# EAGLE design Addon-LAN-WLAN-without-MAPLE_or-OneWire_or_RS485-V01-010 (EAGLE 9.3.0)
MAPLE-CUx Large Version
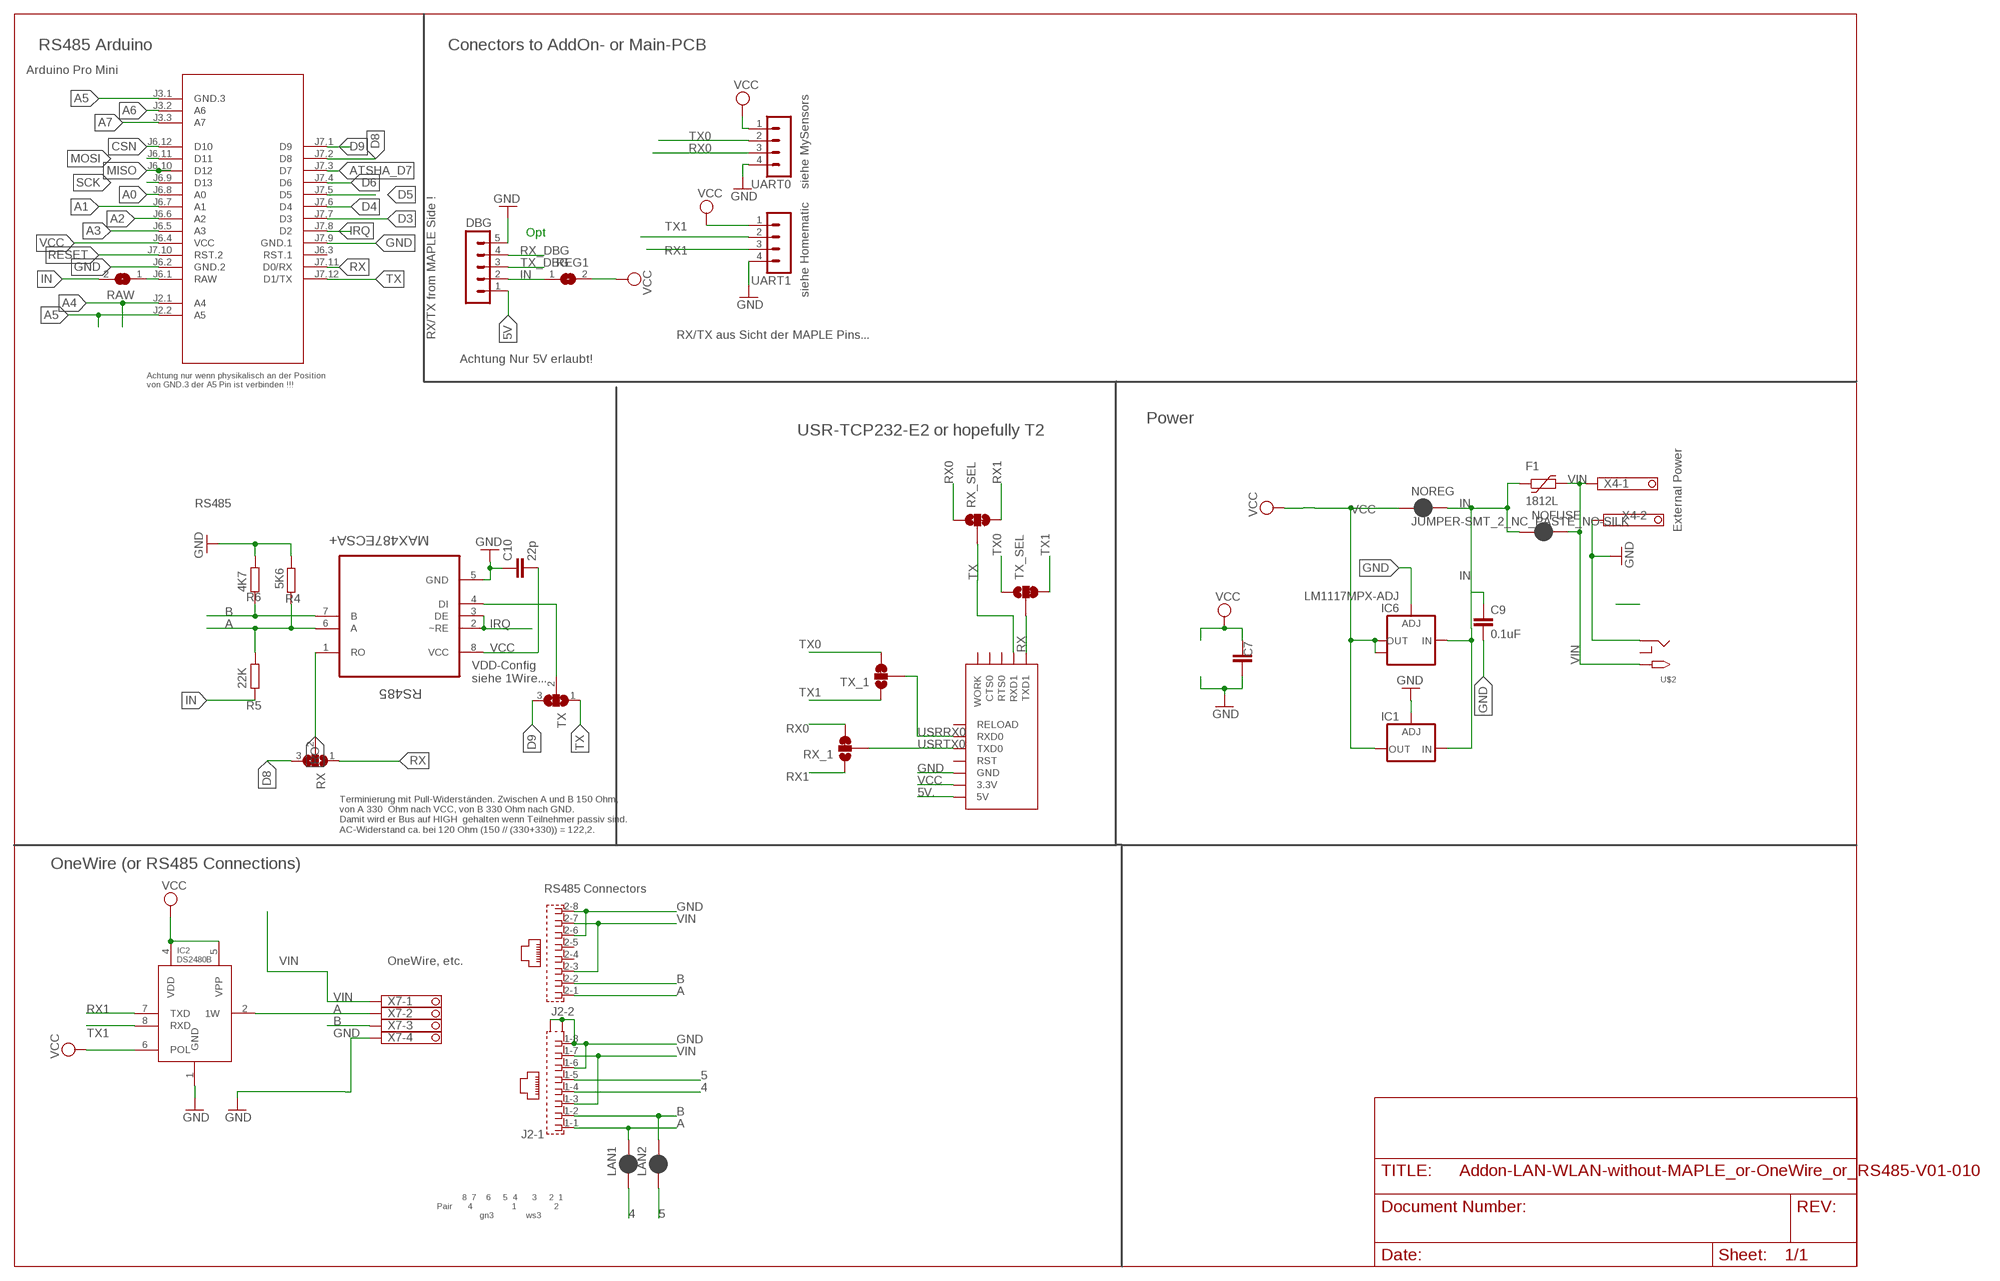
[diagram p0: schematic, sheet 1]

## Parts
C7  C-EUC1812  [C1812]
C9  0.1uF  C-EUC1206  [C1206]
C10  22p  C-EUC0805  [C0805]
DBG  MA05-1  [MA05-1]
F1  1812L  [1812L]
IC1  LD117ADT50TR  [DPACK]
IC2  DS2480B  [SO08]
IC6  LM1117MPX-ADJ  [SOT223]
J2  RJ45_2X_S  [RJ45_2X_S]
LAN1  JUMPER-SMT_2_NC_PASTE_SILK  [SMT-JUMPER_2_NC_PASTE_SILK]
LAN2  JUMPER-SMT_2_NC_PASTE_SILK  [SMT-JUMPER_2_NC_PASTE_SILK]
M1  ARDUINO-PRO-MINI-3.3V#NP  [ARDUINO-PRO-MINI#NP]
NOFUSE  JUMPER-SMT_2_NC_PASTE_NO-SILK  [SMT-JUMPER_2_NC_PASTE_NO-SILK]
NOREG  JUMPER-SMT_2_NC_PASTE_NO-SILK  [SMT-JUMPER_2_NC_PASTE_NO-SILK]
R4  5K6  R-EU_R0805  [R0805]
R5  22K  R-EU_R0805  [R0805]
R6  4K7  R-EU_R0805  [R0805]
RAW  SJ  [SJ]
REG1  SJ  [SJ]
RS485  MAX487ECSA+  [SOIC127P600X175-8N]
RX  SJ2W  [SJ_2]
RX_1  JUMPER-SMT_3_1-NC_TRACE_SILK  [SMT-JUMPER_3_1-NC_TRACE_SILK]
RX_SEL  JUMPER-SMT_3_1-NC_TRACE_SILK  [SMT-JUMPER_3_1-NC_TRACE_SILK]
TX  SJ2W  [SJ_2]
TX_1  JUMPER-SMT_3_1-NC_TRACE_SILK  [SMT-JUMPER_3_1-NC_TRACE_SILK]
TX_SEL  JUMPER-SMT_3_1-NC_TRACE_SILK  [SMT-JUMPER_3_1-NC_TRACE_SILK]
U$2  2.1MMJACKTHM  [PJ-102A]
U$5  USR-TCP232-E2  [USR-TCP232-E2]
UART0  MA04-1  [MA04-1]
UART1  MA04-1  [MA04-1]
X4  1751248  [1751248]
X7  1751264  [1751264]

## Nets
4: J2.1-4 LAN1.1
5: J2.1-5 LAN2.1
5V [PWR]: DBG.1
5V.: U$5.5V
A: IC2.2(1W) J2.1-1 J2.2-1 LAN1.2 R4.2 R5.2 RS485.6(A) X7.2
A0: M1.J6.8(A0)
A1: M1.J6.7(A1)
A2: M1.J6.6(A2)
A3: M1.J6.5(A3)
A4: M1.J2.1(A4)
A5: M1.J2.2(A5) M1.J3.1(GND.3)
A6: M1.J3.2(A6)
A7: M1.J3.3(A7)
ATSHA_D7: M1.J7.3(D7)
B: J2.1-2 J2.2-2 LAN2.2 R6.1 RS485.7(B) X7.3
CSN: M1.J6.12(D10)
D3: M1.J7.7(D3)
D4: M1.J7.6(D4)
D5: M1.J7.5(D5)
D6: M1.J7.4(D6)
D8: M1.J7.2(D8) RX.3
D9: M1.J7.1(D9) TX.3
DI1: RS485.4(DI) TX.2
GND [PWR]: C7.1 C9.2 C10.1 DBG.5 IC1.1(ADJ) IC2.1(GND) IC6.1(ADJ) J2.1-6 J2.1-8 J2.2-6 J2.2-8 J2.G1(-1:S2) J2.G3(-1:S1) M1.J6.2(GND.2) M1.J7.9(GND.1) R4.1 R6.2 RS485.5(GND) U$2.RING U$5.GND UART0.4 UART1.4 X4.2 X7.4
IN [PWR]: C9.1 DBG.2 F1.P$1 IC1.3(IN) IC6.3(IN) NOFUSE.1 NOREG.2 R5.1 RAW.2 REG1.1
IRQ: M1.J7.8(D2) RS485.2(~RE) RS485.3(DE)
MISO: M1.J6.10(D12)
MOSI: M1.J6.11(D11)
RAW1 [PWR]: M1.J6.1(RAW) RAW.1
RESET: M1.J7.10(RST.2)
RO: RS485.1(RO) RX.2
RX: M1.J7.11(D0/RX) RX.1 TX_SEL.2 U$5.TXD1
RX0: RX_1.3 RX_SEL.1 UART0.3
RX1: IC2.7(TXD) RX_1.1 RX_SEL.3 UART1.3
RX_DBG: DBG.4
SCK: M1.J6.9(D13)
TX: M1.J7.12(D1/TX) RX_SEL.2 TX.1 U$5.RXD1
TX0: TX_1.3 TX_SEL.1 UART0.2
TX1: IC2.8(RXD) TX_1.1 TX_SEL.3 UART1.2
TX_DBG: DBG.3
USRRX0: TX_1.2 U$5.RXD0
USRTX0: RX_1.2 U$5.TXD0
VCC [PWR]: C7.2 C10.2 IC1.4(OUT) IC2.4(VDD) IC2.5(VPP) IC2.6(POL) IC6.2(OUT) IC6.TAB(OUT1) M1.J6.4(VCC) NOREG.1 REG1.2 RS485.8(VCC) U$5.3.3V UART0.1 UART1.1
VIN [PWR]: F1.P$2 J2.1-3 J2.1-7 J2.2-3 J2.2-7 NOFUSE.2 U$2.TIP X4.1 X7.1
Unconnected: J2.2-4 J2.2-5 M1.J6.3(RST.1) U$2.RING_SW U$5.CTS0 U$5.RELOAD U$5.RST U$5.RTS0 U$5.WORK

## Notes on the sheet
- RS485 Arduino | Conectors to AddOn- or Main-PCB
- Arduino Pro Mini
- siehe MySensors
- Opt
- siehe Homematic
- RX/TX from MAPLE Side ! | RX/TX aus Sicht der MAPLE Pins...
- Achtung Nur 5V erlaubt!
- Achtung nur wenn physikalisch an der Position 
  von GND.3 der A5 Pin ist verbinden !!!
- Power
- USR-TCP232-E2 or hopefully T2
- RS485
- External Power
- VDD-Config
  siehe 1Wire...
- Terminierung mit Pull-Widerständen. Zwischen A und B 150 Ohm,
  von A 330  Ohm nach VCC, von B 330 Ohm nach GND. 
  Damit wird er Bus auf HIGH  gehalten wenn Teilnehmer passiv sind.
  AC-Widerstand ca. bei 120 Ohm (150 // (330+330)) = 122,2.
- OneWire (or RS485 Connections)
- RS485 Connectors
- OneWire, etc.
- 8  7    6     5  4      3     2  1
  Pair      4                1               2
                   gn3             ws3

## Library data of the parts
C7 C9 = rcl:C-EU: CAPACITOR, European symbol; SPICEPREFIX: C
C10 = rcl:C-EU: CAPACITOR, European symbol
DBG = con-lstb:MA05-1: PIN HEADER; OC_FARNELL: unknown; OC_NEWARK: unknown
F1 = ptc-littlefuse:1812L
IC1 = v-reg:LD117A?*: Low drop fixed and adjustable positive voltage regulators 1 A Source: http://www.st.com/stonline/products/literature/ds/7194/ld1117axx.pdf
IC2 = 1wire:DS2480B: RS232 to 1-Wire Host Adapter/Line Driver with Load Sensor This device is a onewire host and UART interface in one chip. It provides the complete DC/AC requirements for onewire communication, including overdrive speed mode and 12V EPROM programming. On the UART side, it can operate at 9.6kBaud (default), 19.2kBaud, 57.6kBaud, and 115.2kBaud. The RxD and TxD lines are operated at 0V/5V. The POL pin selects the RxD and TxD "polarity", that means straight-through or inverted. If POL is connected to GND, RxD and TxD behave properly for connection to inverted RS232 drivers, like the MC1488/1489 or MAX23x chips. If POL is connected to Vdd, RxD and TxD behave properly for direct connection to a 0V/5V UART chip. Important Notes: RxD and TxD are seen from the UART point of view, that means the DS2480B TxD pin is really an input and the DS2480B RxD pin is really an output. Vpp must be connected to 5V/Vdd if EPROM programming is not required. Vdd must be always lower than or equal to Vpp, otherwise the chip will be damaged. Best idea is to provide a separate 12V->5V/5mA voltage regulator from Vpp to Vdd if EPROM programming is required. Author: Jan Kandziora <jjj@gmx.de>
IC6 = lm1117:LM1117MPX-ADJ
J2 = RJ45:RJ45_2X_S: AMP connector
LAN1 LAN2 NOFUSE NOREG = SparkFun-Jumpers:JUMPER-SMT_2_NC_PASTE: Normally closed solder jumper This jumper has an aperture in the stencil to allow solder paste to bridge the split in the wire so it's normally closed (NC). Wick off the solder to open the connection. Reapply solder to reclose the connection.
M1 = diy-modules:ARDUINO-PRO-MINI-*#NP: Arduino Pro Mini without programming pads
R4-R6 = rcl:R-EU_: RESISTOR, European symbol
RAW REG1 = jumper:SJ: SMD solder JUMPER
RS485 = Maxim_By_element14_Batch_1:MAX487ECSA+: Low-Power, Slew-Rate-Limited RS-485/RS-422 Transceivers; MPN: MAX487ECSA+; OC_FARNELL: 9724532; OC_NEWARK: 68K4803; PACKAGE: SOIC-8; SUPPLIER: Maxim
RX TX = jumper:SJ2W: SMD solder JUMPER
RX_1 RX_SEL TX_1 TX_SEL = SparkFun-Jumpers:JUMPER-SMT_3_1-NC_TRACE: Normally closed trace jumper (1 of 2 connections) This jumper has a trace between two pads so it's normally closed (NC). The other connection is normally open (NO). Use a razor knife to open the connection. For best results follow the IPC guidelines for cutting traces: Cutout at least 0.063 mm (0.005 in). Remove all loose material to clean up the cut area. Seal the cut with an approved epoxy. Reapply solder to reclose the connection, or to close the NO connection.
U$2 = adafruit:2.1MMJACK: 2.1mm x 5.5mm THM DC jack with internal switch. Digikey part #PJ-102A, 4UCON part #05537 2.1mm x 5.5mm SMT DC jack with internal switch. Digikey part #PJ-002A-SMT, 4UCON part #03267 By microbuilder.eu & adafruit.com
U$5 = #Usr-tcp232:USR-TCP232-E2
UART0 UART1 = con-lstb:MA04-1: PIN HEADER; OC_FARNELL: unknown; OC_NEWARK: unknown
X4 = con-phoenix-350:1751248: MKDS 1/ 2-3,5 Printklemme Nennstrom: 10 A Bemessungsspannung: 160 V Raster: 3,5 mm Polzahl: 2 Montageart: Löten Anschlussart: Schraubanschluss Anschlussrichtung vom Leiter zur Platine: 0° Source: http://eshop.phoenixcontact.com .. 1751248.pdf; OC_FARNELL: unknown; OC_NEWARK: unknown
X7 = con-phoenix-350:1751264: MKDS 1/ 4-3,5 Printklemme Nennstrom: 10 A Bemessungsspannung: 160 V Raster: 3,5 mm Polzahl: 4 Montageart: Löten Anschlussart: Schraubanschluss Anschlussrichtung vom Leiter zur Platine: 0° Source: http://eshop.phoenixcontact.com .. 1751264.pdf; MPN: 1751264; OC_FARNELL: unknown; OC_NEWARK: 10R0934

## Net classes
0 default: width 0.305 mm
1 PWR: width 0.508 mm

## Board
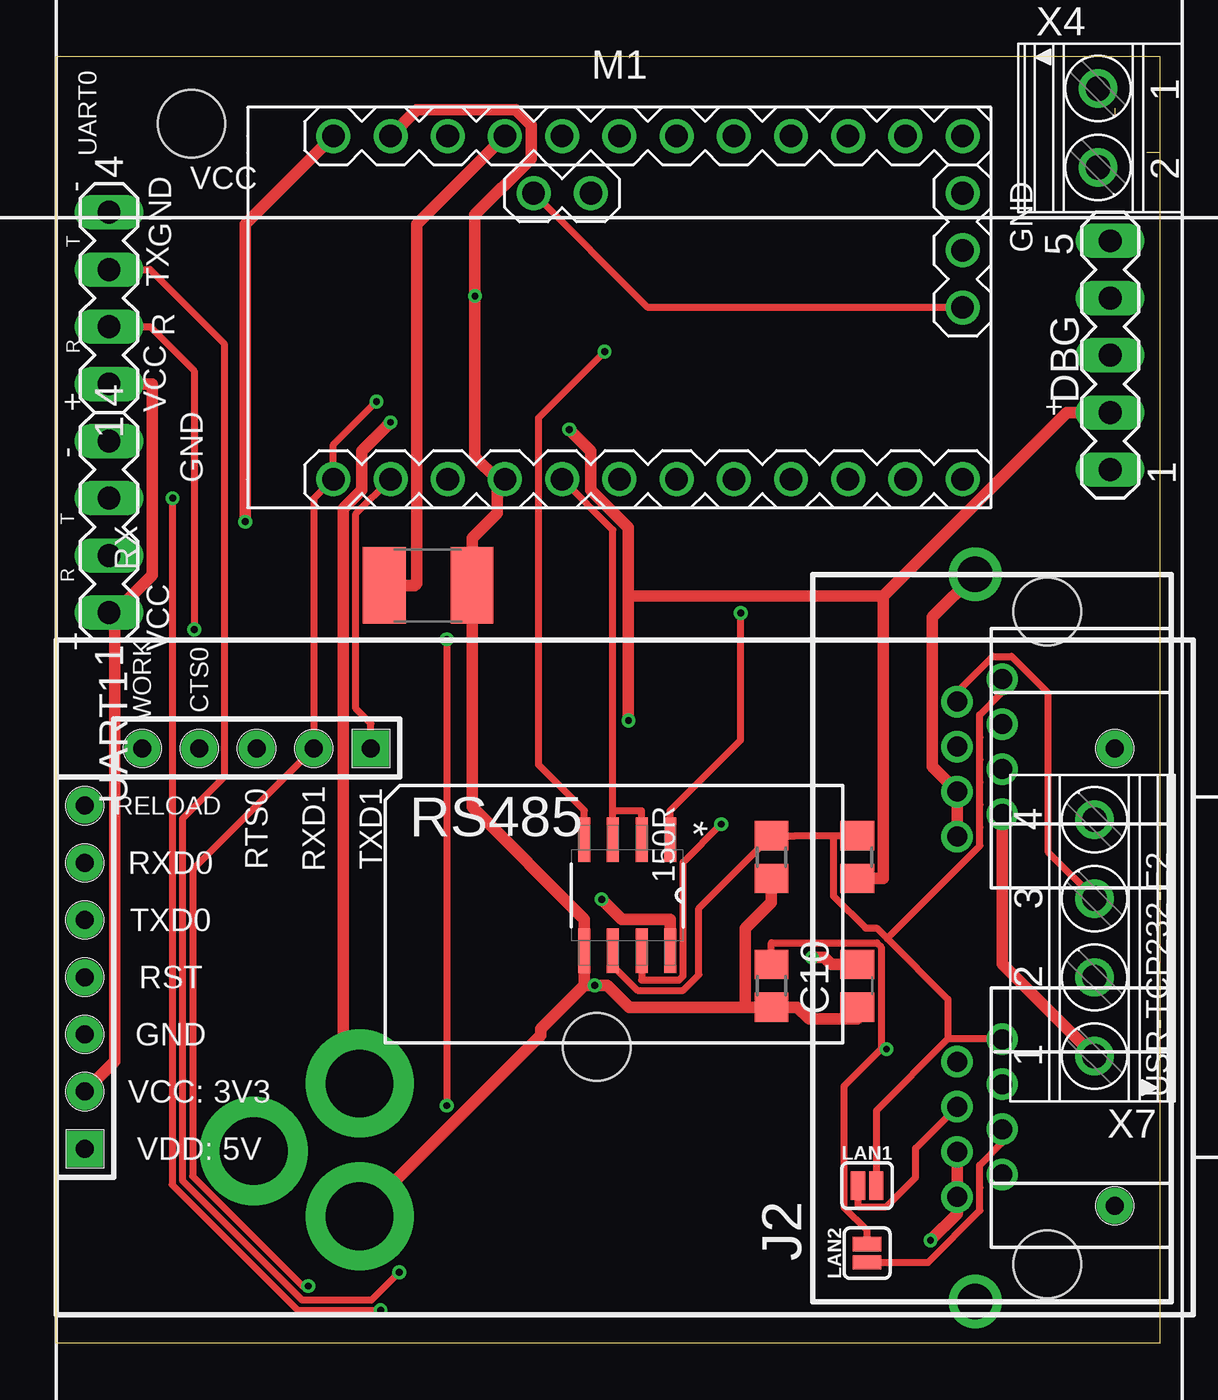
[diagram p1: board, top side]
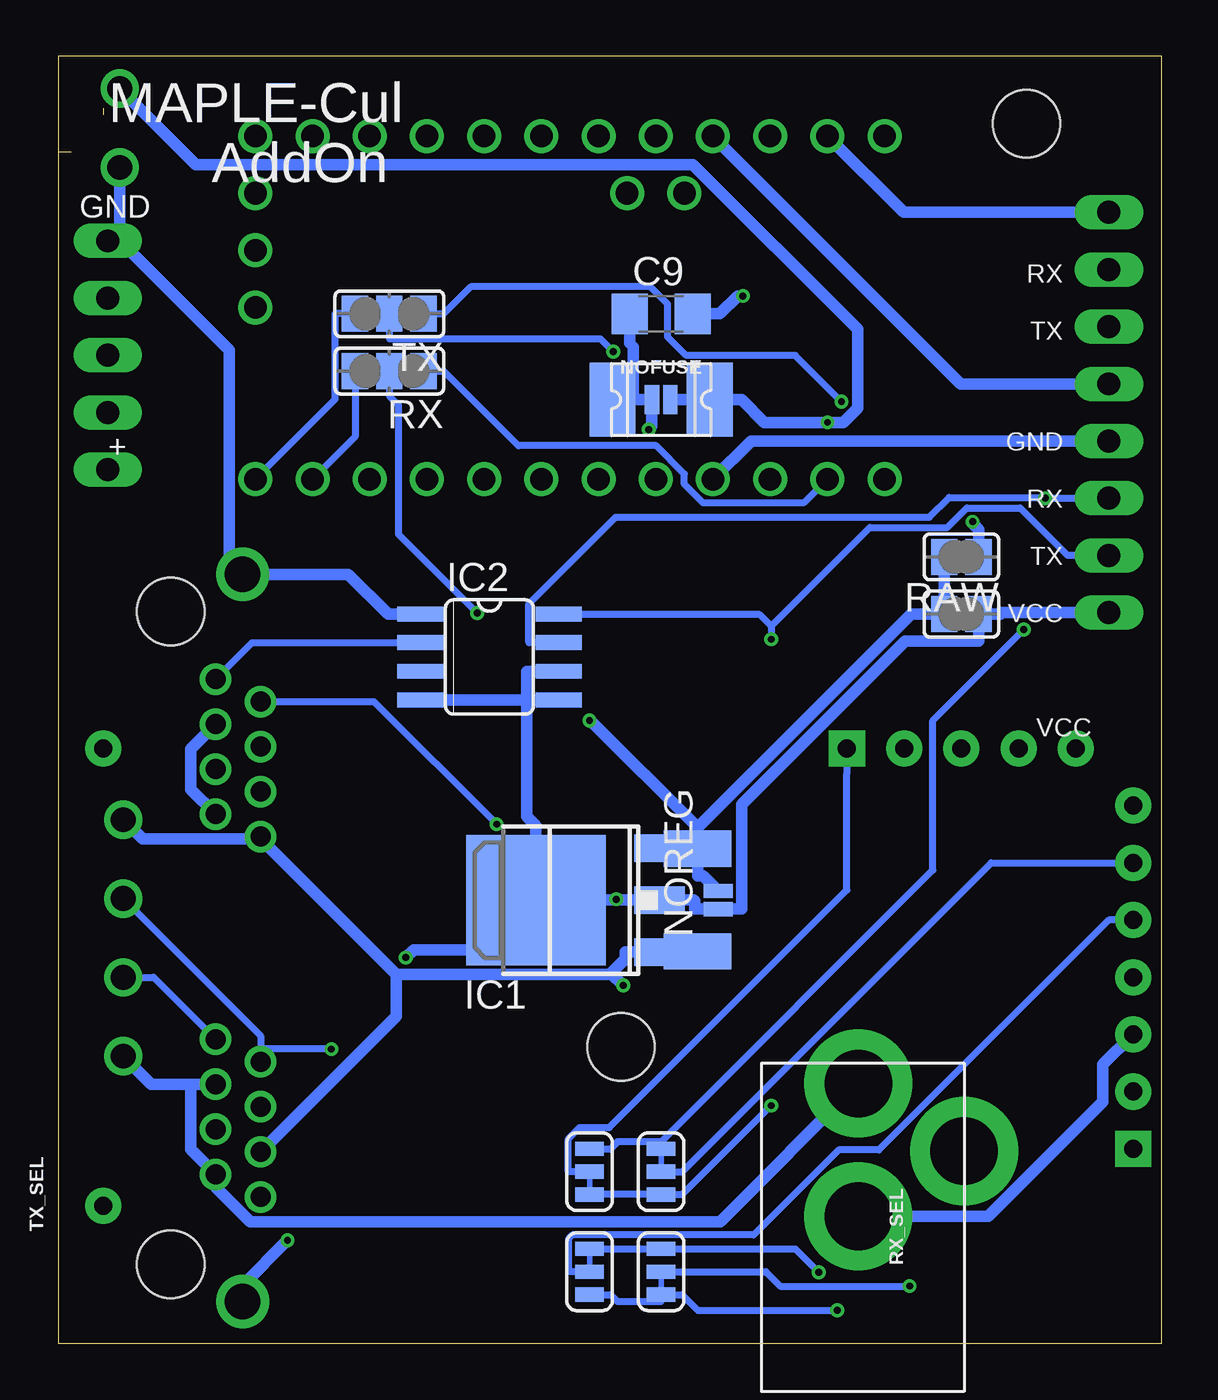
[diagram p2: board, bottom side, seen from below]

Size 49 x 57.16 mm. Coordinates in mm from the lower left corner, seen from the top.
Outline: 49,57.16 49,56.4
Outline: 47,54.86 47,54.57
Outline: 48.41,52.91 49,52.91
Outline: 49,57.16 0,57.16 0,0 49,0 49,52.91
Outline: 49,57.16 49,52.91
Copper layers (1*16): Top 0.035mm / dielectric 1.5mm / Bottom 0.035mm
Design rules "SeeedStudio_2layer_DRU_no_angle_20140221": minimum track width 6mil, minimum drill 12mil, track to track 6mil, track to pad 6mil, pad to pad 6mil, via to via 6mil, smd to smd 0mil, copper to edge 10mil, drill to drill 10mil, minimum pad ring 10mil, minimum via ring 6mil, stop-mask expansion 2mil, vias tented up to drill 100mil, thermal gap 10mil
Holes 3 mm at 6,54.16 24,13.16
tRestrict: area 0.4,25.5 to 1.1,57.2
bRestrict: area 0.4,25.5 to 1.1,56.6

### Footprints (pad centres in the part's own frame; a part is rotated, then mirrored left to right if it is on the bottom)
C1812 = smd 1.9 x 3.4: 1 -1.95,0; 2 1.95,0
C1206 = smd 1.6 x 1.8: 1 -1.4,0; 2 1.4,0
C0805 = smd 1.3 x 1.5: 1 -0.95,0; 2 0.95,0
MA05-1 = drill 1.016 long: 1 -5.08,0; 2 -2.54,0; 3 0,0; 4 2.54,0; 5 5.08,0
1812L = smd 2.03 x 3.3: P$1 -2.16,0; P$2 2.16,0
DPACK = smd 1.6 x 3: 1 -2.28,-4.8; 3 2.28,-4.8 | smd 5.8 x 6.2: 4 0,2.38
SO08 = smd 0.66 x 2.032: 1 -1.905,-3.073; 2 -0.635,-3.073; 3 0.635,-3.073; 4 1.905,-3.073; 5 1.905,3.073; 6 0.635,3.073; 7 -0.635,3.073; 8 -1.905,3.073
SOT223 = smd 1.219 x 2.235: 1 -2.311,-3.099; 2 0,-3.099; 3 2.311,-3.099 | smd 3.6 x 2.2: TAB 0,3.099
RJ45_2X_S = drill 0.889: 1-1 -4.5,2; 1-2 -5.5,4; 1-3 -6.5,2; 1-4 -7.5,4; 1-5 -8.5,2; 1-6 -9.5,4; 1-7 -10.5,2; 1-8 -11.5,4; 2-1 11.5,2; 2-2 10.5,4; 2-3 9.5,2; 2-4 8.5,4; 2-5 7.5,2; 2-6 6.5,4; 2-7 5.5,2; 2-8 4.5,4 | drill 1.575 pad 2.184: G1 -16.15,3.2; G3 16.15,3.2 | hole 3: -14.5,0; 14.5,0
SMT-JUMPER_2_NC_PASTE_SILK = smd 0.635 x 1.27: 1 -0.406,0; 2 0.406,0
ARDUINO-PRO-MINI#NP = drill 1: J2.1 -1.27,5.08; J2.2 -3.81,5.08; J3.1 15.24,0; J3.2 15.24,2.54; J3.3 15.24,5.08; J6.1 -12.7,7.62; J6.2 -10.16,7.62; J6.3 -7.62,7.62; J6.4 -5.08,7.62; J6.5 -2.54,7.62; J6.6 0,7.62; J6.7 2.54,7.62; J6.8 5.08,7.62; J6.9 7.62,7.62; J6.10 10.16,7.62; J6.11 12.7,7.62; J6.12 15.24,7.62; J7.1 15.24,-7.62; J7.2 12.7,-7.62; J7.3 10.16,-7.62; J7.4 7.62,-7.62; J7.5 5.08,-7.62; J7.6 2.54,-7.62; J7.7 0,-7.62; J7.8 -2.54,-7.62; J7.9 -5.08,-7.62; J7.10 -7.62,-7.62; J7.11 -10.16,-7.62; J7.12 -12.7,-7.62
SMT-JUMPER_2_NC_PASTE_NO-SILK = smd 0.635 x 1.27: 1 -0.406,0; 2 0.406,0
R0805 = smd 1.3 x 1.5: 1 -0.95,0; 2 0.95,0
SJ = smd 1.168 x 1.6: 1 -0.762,0; 2 0.762,0
SOIC127P600X175-8N = smd 1.981 x 0.533: 1 -2.464,1.905; 2 -2.464,0.635; 3 -2.464,-0.635; 4 -2.464,-1.905; 5 2.464,-1.905; 6 2.464,-0.635; 7 2.464,0.635; 8 2.464,1.905
SJ_2 = smd 1.168 x 1.6: 1 -1.524,0; 2 0,0; 3 1.524,0
SMT-JUMPER_3_1-NC_TRACE_SILK = smd 0.635 x 1.27: 1 -1.016,0; 2 0,0; 3 1.016,0
PJ-102A = drill 3 pad 4.8: RING 0.1,-3.39; RING_SW -4.6,-6.29; TIP 0.1,-9.29
USR-TCP232-E2 = drill 0.8 pad 1.6: 3.3V 1.27,9.906; CTS0 6.35,25.146; GND 1.27,12.446; P$13 46.99,25.146; P$14 46.99,4.826; RELOAD 1.27,22.606; RST 1.27,14.986; RTS0 8.89,25.146; RXD0 1.27,20.066; RXD1 11.43,25.146; TXD0 1.27,17.526; WORK 3.81,25.146 | drill 0.8 pad 1.6 square: 5V 1.27,7.366; TXD1 13.97,25.146
MA04-1 = drill 1.016 long: 1 -3.81,0; 2 -1.27,0; 3 1.27,0; 4 3.81,0
1751248 = drill 1.1 pad 1.7: 1 -1.75,-0.1; 2 1.75,-0.1
1751264 = drill 1.1 pad 1.7: 1 -5.25,-0.1; 2 -1.75,-0.1; 3 1.75,-0.1; 4 5.25,-0.1

### Placement (x,y rotation side)
C7  16.51,33.66 180 top
C9  22.23,45.72 0 bottom
C10  35.56,15.88 90 top
DBG  46.79,43.88 90 top
F1  22.23,41.91 0 bottom
IC1  25.4,19.68 90 bottom
IC2  29.84,30.48 270 bottom
IC6  25.4,19.68 90 bottom
J2  44,18 90 top
LAN1  36,7 0 top
LAN2  36,4 90 top
M1  25,46 0 top
NOFUSE  22.23,41.91 0 bottom
NOREG  19.68,19.68 90 bottom
R4  31.75,21.59 90 top
R5  35.56,21.59 90 top
R6  31.75,15.88 270 top
RAW  8.89,34.92 180 bottom
REG1  8.89,32.38 0 bottom
RS485  25.35,19.89 270 top
RX  34.29,43.18 180 bottom
RX_1  25.4,3.17 90 bottom
RX_SEL  22.23,3.17 270 bottom
TX  34.29,45.72 180 bottom
TX_1  22.23,7.62 90 bottom
TX_SEL  25.4,7.62 270 bottom
U$2  13.37,2.25 180 bottom
U$5  0,1.27 0 top
UART0  2.34,46.42 90 top
UART1  2.34,36.26 90 top
X4  46.35,53.98 270 top
X7  46,18 90 top

### Tracks (layer width: path | path; a pad name or v marks a point on that pad's centre or on a via)
4
  Top 0.305: LAN1.1 35.59,6.06 36.85,6.06 38.16,7.36 38.16,8.66 J2.1-4
5
  Top 0.305: LAN2.1 38.71,3.59 41.01,5.89 41.01,6.91 40.99,6.93 40.99,7.91 42,8.92 J2.1-5
A
  Top 0.305: 36.89,17.97 39.59,15.28 39.59,13.51 | 34.51,22.54 34.51,19.86 35.93,18.44 36.42,18.44 36.89,17.97 | 36.89,17.97 41.01,22.09 41.01,22.91 40.99,22.93 40.99,23.91 41.01,23.93 41.01,24.91 40.99,24.93 40.99,25.91 41.01,25.93 41.01,26.91 40.99,26.93 40.99,27.91 42,28.92 J2.2-1 | 39.59,13.51 36.41,10.33 LAN1.2 | J2.1-1 39.59,13.51 | 34.51,22.54 32.8,22.54 R4.2 28.53,19.32 28.53,16.36 27.84,15.67 25.8,15.67 24.71,16.75 RS485.6 | R5.2 34.51,22.54
  Bottom 0.305: X7.2 44.75,16.25 J2.1-1 | J2.2-1 40.38,31.11 IC2.2
A5
  Top 0.305: M1.J3.1 26.27,46 M1.J2.2
B  (via drill 0.3 pad 0.61)
  Top 0.305: 36.62,13.06 34.97,11.42 34.97,6.04 35.98,5.03 36,5.03 LAN2.2 | 36.62,13.06 36.62,17.6 36.44,17.78 31.75,17.78 R6.1 | 36.62,13.06 v36.86,13.06 | v29.52,23.05 27.83,21.36 27.83,16.31 27.65,16.14 25.98,16.14 RS485.7 | J2.2-2 40,28.92 41.59,30.51 42.42,30.51 44.02,28.9 44.02,21.83 X7.3
  Bottom 0.305: 40,13.06 J2.1-2 | X7.3 40,13.65 40,13.06 | v36.86,13.06 40,13.06 | J2.2-2 34.97,28.5 v29.52,23.05
D8
  Bottom 0.305: RX.3 35.81,40.27 M1.J7.2
D9
  Bottom 0.305: TX.3 36.7,45.72 36.7,41.92 M1.J7.1
DI1  (via drill 0.3 pad 0.61)
  Top 0.305: v24.34,44.04 21.4,41.1 21.4,25.7 23.45,23.65 RS485.4
  Bottom 0.305: TX.2 34.29,44.62 24.92,44.62 v24.34,44.04
GND  (via drill 0.3 pad 0.61)
  Top 0.508: 30.59,14.93 25.43,14.93 24.47,15.89 v23.91,15.89 23.45,15.89 | C10.1 35.56,14.4 33.44,14.4 32.91,14.93 R6.2 30.59,14.93 | 19.58,38.38 19.58,36.88 18.46,35.76 C7.1 18.46,23.81 23.45,18.83 RS485.5 23.45,17.4 23.45,17.36 23.45,15.89 | 19.58,38.38 18.59,39.37 v18.59,46.51 18.59,50.12 21.08,52.62 21.08,54.1 20.4,54.78 16,54.78 M1.J6.2 | M1.J7.9 19.58,38.38 | J2.G3 38.89,32.24 38.89,25.61 J2.2-6 J2.2-8 | v38.81,4.57 40,5.75 J2.1-8 J2.1-6 | U$2.RING 21.5,13.67 21.5,13.95 23.45,15.89 | R4.1 31.75,19.58 30.59,18.43 30.59,14.93
  Bottom 0.508: 46.26,48.96 41.4,44.1 41.4,34.75 J2.G3 36.11,34.15 34.34,32.38 IC2.1 | 24.45,16.44 23.82,17.06 23.82,17.37 23.06,17.37 22.54,17.37 | 33.98,16.38 24.51,16.38 24.45,16.44 | 24.45,16.44 v23.91,15.89 | 40.05,22.45 33.98,16.38 | 33.98,16.38 33.98,14.52 J2.1-6 | DBG.5 46.26,48.96 | X4.2 46.26,48.96 | 22.54,17.37 22.51,17.41 IC1.1 | IC6.1 22.54,17.37 | U$2.RING 7.69,5.63 2.6,10.72 2.6,12.38 U$5.GND | 40.05,22.45 J2.2-8 | X7.4 45.24,22.39 40.11,22.39 40.05,22.45 | J2.G1 40.8,2.58 v38.81,4.57 | v18.59,46.51 18.83,46.51 19.62,45.72 C9.2 | M1.J7.9 18.23,40.07 UART1.4 | UART0.4 11.45,50.23 M1.J6.2
IN  (via drill 0.3 pad 0.61)
  Top 0.508: 25.41,33.2 25.41,36.23 23.73,37.9 23.73,39.63 v22.77,40.59 | v25.41,27.66 25.41,33.2 | 25.41,33.2 36.72,33.2 | 36.72,33.2 44.86,41.34 DBG.2 | 36.72,33.2 36.72,20.64 R5.1
  Bottom 0.508: C9.1 23.62,44.41 23.46,44.25 23.46,41.91 | 23.46,41.91 22.96,41.91 NOFUSE.1 22.63,40.73 v22.77,40.59 | F1.P$1 23.46,41.91 | 20.6,22.9 11.12,32.38 10.64,32.38 REG1.1 RAW.2 | 20.6,22 20.6,22.9 | 20.6,22.9 25.36,27.66 v25.41,27.66 | 20.6,22 IC1.3 20.6,20.76 20.35,20.76 NOREG.2 | 20.6,22 20.78,22 IC6.3
IRQ
  Top 0.305: 24.71,23.65 24.71,36.12 M1.J7.8 | RS485.3 24.71,23.65 | 24.71,23.65 25.98,23.65 RS485.2
RAW1  (via drill 0.3 pad 0.61)
  Top 0.508: v8.39,36.49 8.39,49.71 M1.J6.1
  Bottom 0.508: RAW.1 8.13,36.13 8.39,36.4 v8.39,36.49
RO  (via drill 0.3 pad 0.61)
  Top 0.305: v30.39,32.43 30.39,26.79 27.25,23.65 RS485.1
  Bottom 0.305: RX.2 34.29,42.08 33.89,41.67 33.89,35.93 v30.39,32.43
RX
  Top 0.305: U$5.TXD1 13.97,27.52 13.3,28.19 13.3,36.84 M1.J7.11
  Bottom 0.305: 13.97,25.31 13.97,20.13 24.52,9.58 25.84,9.58 26.34,9.08 26.34,7.62 TX_SEL.2 | 13.97,25.31 | RX.1 31.88,43.18 28.56,39.86 22.44,39.86 21.19,38.61 21.19,38.15 20.36,37.32 15.9,37.32 M1.J7.11 | U$5.TXD1 13.97,25.31
RX0  (via drill 0.3 pad 0.61)
  Top 0.305: v15.23,3.15 14,1.92 10.9,1.92 5.6,7.23 5.6,23.29 7.46,25.15 7.46,44.4 4.17,47.69 UART0.3
  Bottom 0.305: v15.23,3.15 16.26,4.19 21.29,4.19 RX_SEL.1 RX_1.3
RX1  (via drill 0.3 pad 0.61)
  Top 0.305: v5.16,37.53 5.14,37.51 5.14,7.04 10.72,1.46 v14.4,1.46
  Bottom 0.305: v14.4,1.46 20.59,1.46 21.29,2.16 RX_SEL.3 22.23,1.85 24.15,1.85 24.46,2.16 RX_1.1 | UART1.3 v5.16,37.53 5.2,37.56 9.44,37.56 10.31,36.69 24.25,36.69 28.09,32.84 28.09,31.11 IC2.7
TX  (via drill 0.3 pad 0.61)
  Top 0.305: v11.19,2.54 10.94,2.54 6.06,7.42 6.06,21.04 U$5.RXD1 11.43,37.51 M1.J7.12 12.3,39.9 v14.21,41.82
  Bottom 0.305: RX_SEL.2 17.57,3.17 16.94,2.54 v11.19,2.54 | TX.1 31.88,45.72 30.67,46.92 22.7,46.92 21.93,46.16 21.93,44.69 21.1,43.87 16.26,43.87 v14.21,41.82
TX0  (via drill 0.3 pad 0.61)
  Top 0.305: v6.12,31.7 6.12,43.2 4.17,45.15 UART0.2
  Bottom 0.305: 22.23,8.95 10.16,21.01 10.16,27.66 v6.12,31.7 | TX_SEL.1 24.46,8.64 24.15,8.95 22.23,8.95 | TX_1.3 22.23,8.95
TX1  (via drill 0.3 pad 0.61)
  Top 0.305: v17.34,31.27 v17.34,10.55
  Bottom 0.305: 17.34,31.85 12.95,36.23 9.51,36.23 8.64,37.1 6.28,37.1 4.17,34.99 UART1.2 | v17.34,10.55 21.29,6.6 TX_1.1 TX_SEL.3 | 17.34,31.85 v17.34,31.27 | 17.34,31.85 17.87,32.38 25.57,32.38 IC2.8
USRRX0
  Bottom 0.305: U$5.RXD0 7.57,21.34 21.29,7.62 TX_1.2
USRTX0
  Bottom 0.305: RX_1.2 26.34,3.17 26.34,4.64 26.16,4.81 18.12,4.81 14.35,8.59 12.55,8.59 2.34,18.8 U$5.TXD0
VCC  (via drill 0.3 pad 0.61)
  Top 0.508: v24.21,19.72 25.1,18.83 27.25,18.83 RS485.8 | v33.56,17.13 34.1,17.13 34.4,16.82 C10.2 | C7.2 15.92,33.66 16,33.74 16,49.7 M1.J6.4 | 2.6,32.45 4.27,34.12 4.27,42.61 UART0.1 | U$5.3.3V 2.6,12.51 2.6,32.45 | UART1.1 2.6,32.45
  Bottom 0.508: 24.27,19.68 24.24,19.72 v24.21,19.72 | 24.27,19.68 IC6.2 20.78,19.68 20.73,19.63 20.73,19.28 NOREG.1 19.16,19.28 18.64,19.28 18.64,23.92 11.39,31.18 8.13,31.18 REG1.2 7.14,32.38 7.07,32.45 UART1.1 | IC1.4 24.27,19.68 | v33.56,17.13 33.21,17.48 28.5,17.48 IC6.TAB IC1.4 | IC1.4 27.78,22.99 28.19,23.41 28.19,28.57 | 28.19,28.57 31.5,28.57 IC2.4 | IC2.6 28.19,29.84 28.19,28.57 | IC2.5 28.19,28.57 | M1.J6.4 8.91,42.61 UART0.1
VIN  (via drill 0.3 pad 0.61)
  Top 0.508: U$2.TIP 12.74,12.26 12.74,37.07 13.57,37.9 13.57,39.63 v14.84,40.9 | J2.2-7 42,16.85 X7.1
  Bottom 0.508: X4.1 42.88,52.35 20.81,52.35 13.5,45.04 13.5,41.53 14.13,40.9 v14.84,40.9 17.63,40.9 18.64,41.91 F1.P$2 NOFUSE.2 | 43.1,11.5 43.1,8.61 J2.1-7 42,6.93 40.46,5.39 19.61,5.39 U$2.TIP | 43.1,11.5 J2.1-3 | X7.1 44.85,11.5 43.1,11.5 | J2.2-7 43.11,24.61 43.11,26.39 J2.2-3

### Text on the board
tNames: GND | GND | VCC | - | T | GND | TX | R | R | + | VCC | + | - | GND | T | R | RX | VCC | VCC | + | RS485 | 150R | GND | GND | PWR-IN
bNames: GND | for 3V3 Serial Raspi AddOns / and CC2530 V0.3 | MAPLE-Cul / AddOn | GND | RX | TX | GND | + | RX | VCC | TX | VCC | VCC | older Board dont have 5 Pins => | GND | GND | GND | VCC | VIN | GND | + | VCC | GND